# Altium schematic sheet Top.SchDoc
size A3
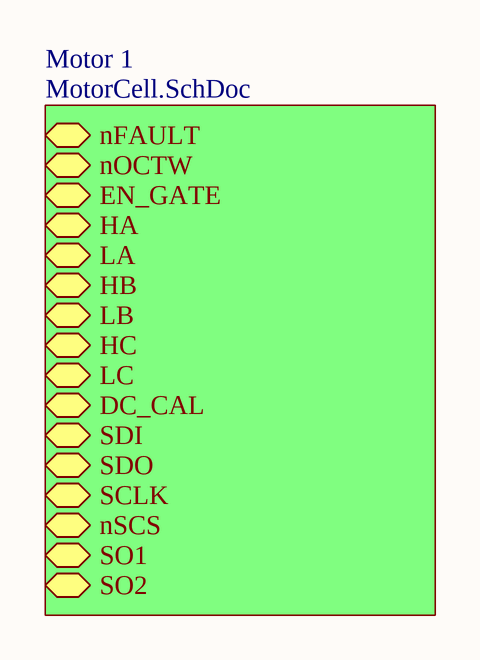
[diagram p0: Top.SchDoc]

## Sub-sheets
Motor 1 = MotorCell.SchDoc: nFAULT, nOCTW, EN_GATE, HA, LA, HB, LB, HC, LC, DC_CAL, SDI, SDO, SCLK, nSCS, SO1, SO2